# EAGLE schematic ext_board (EAGLE 5.01)
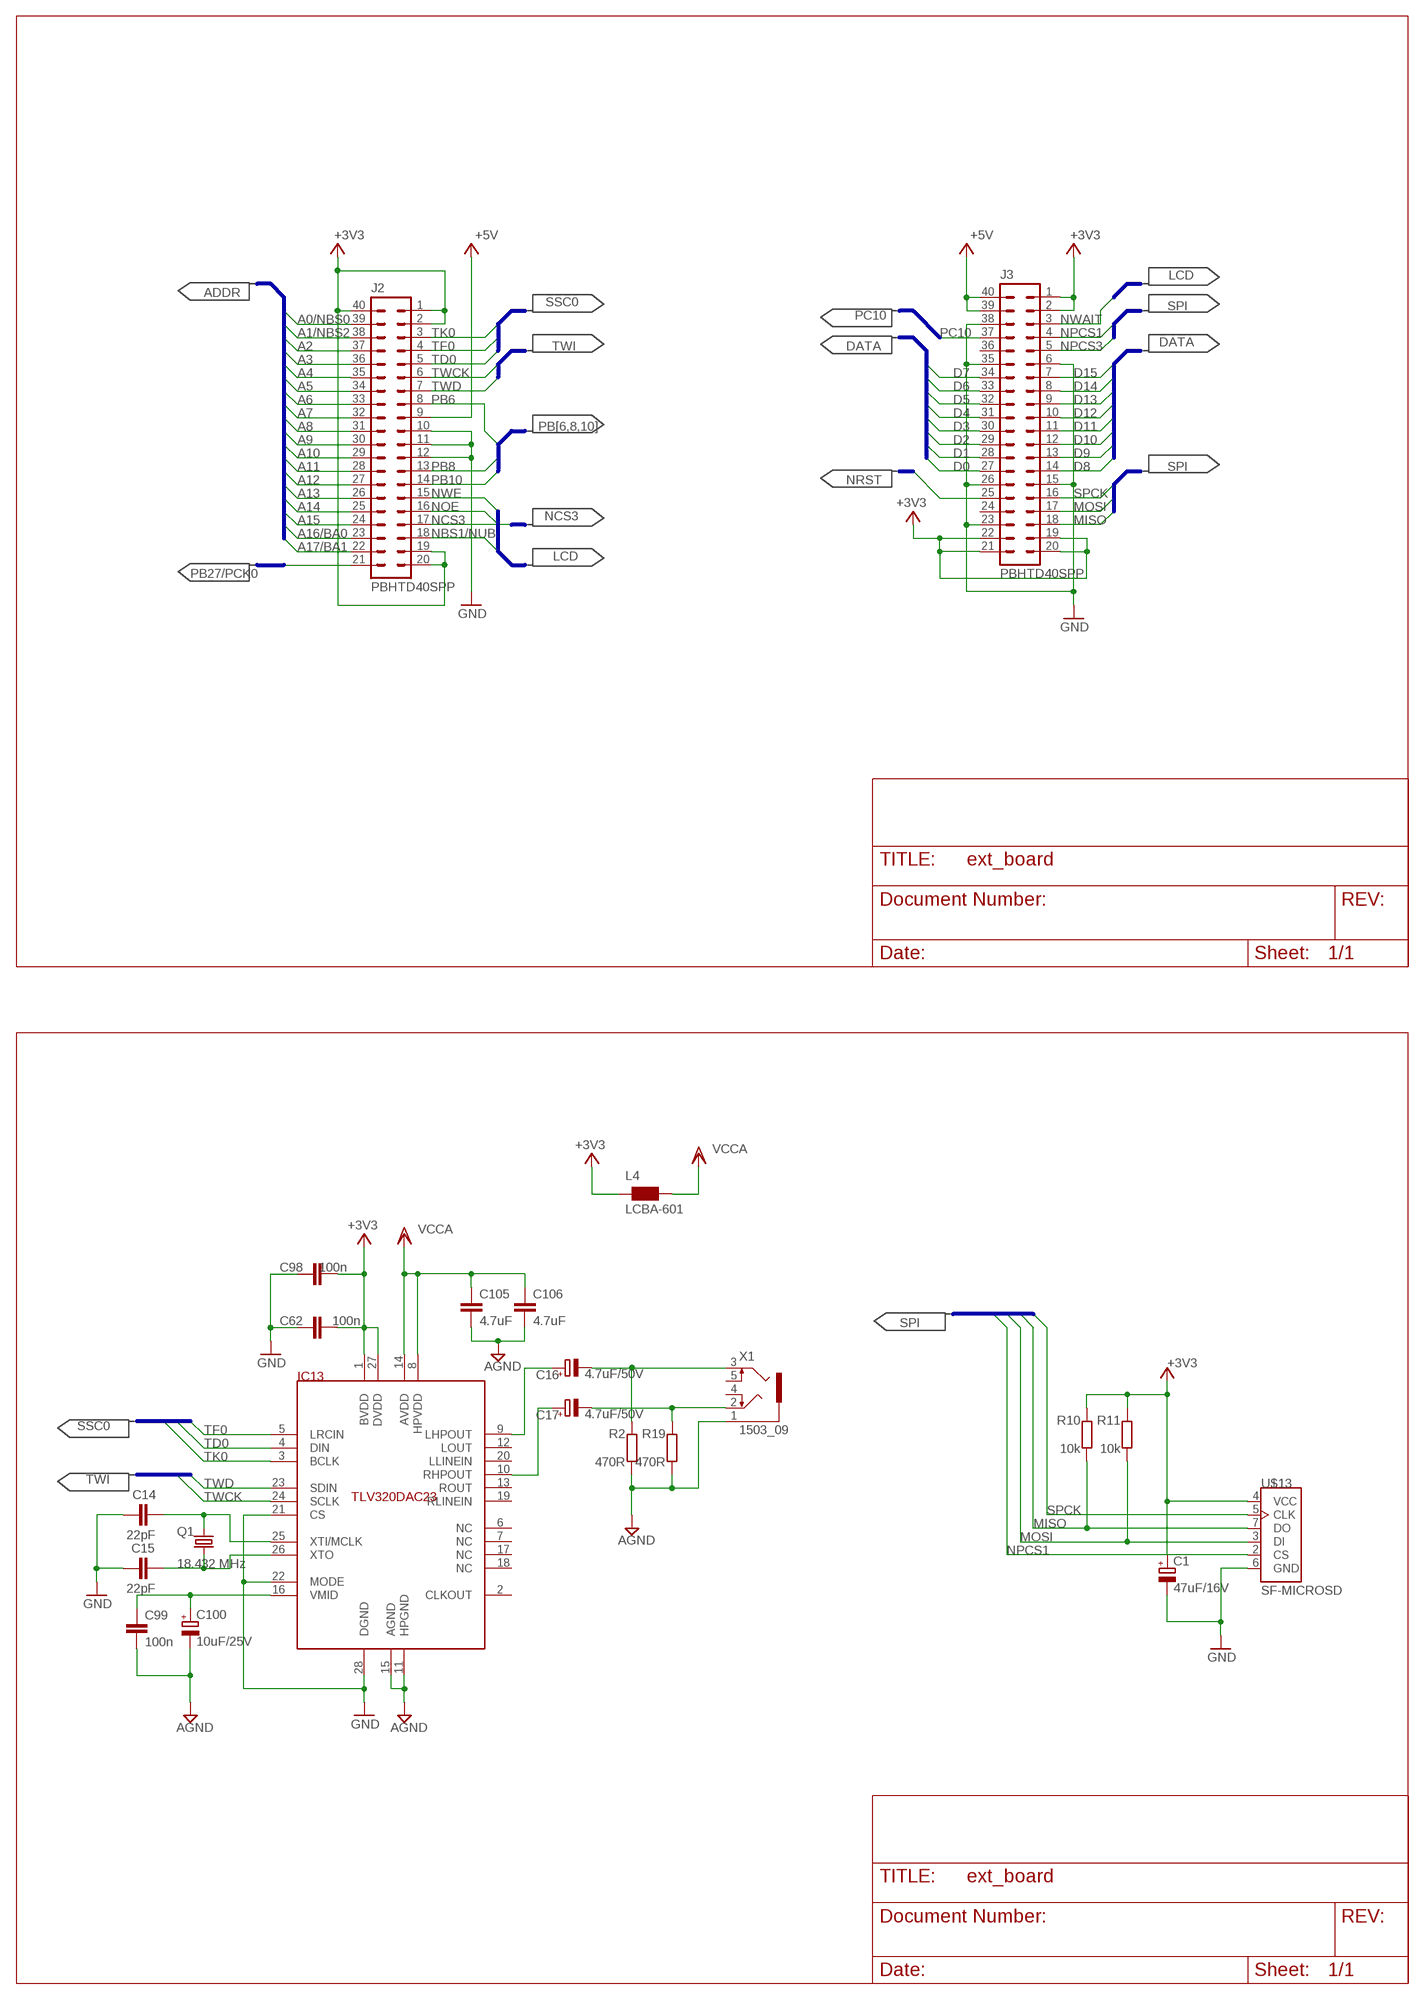
[diagram p0: schematic, sheet 1, part 1 of 2]
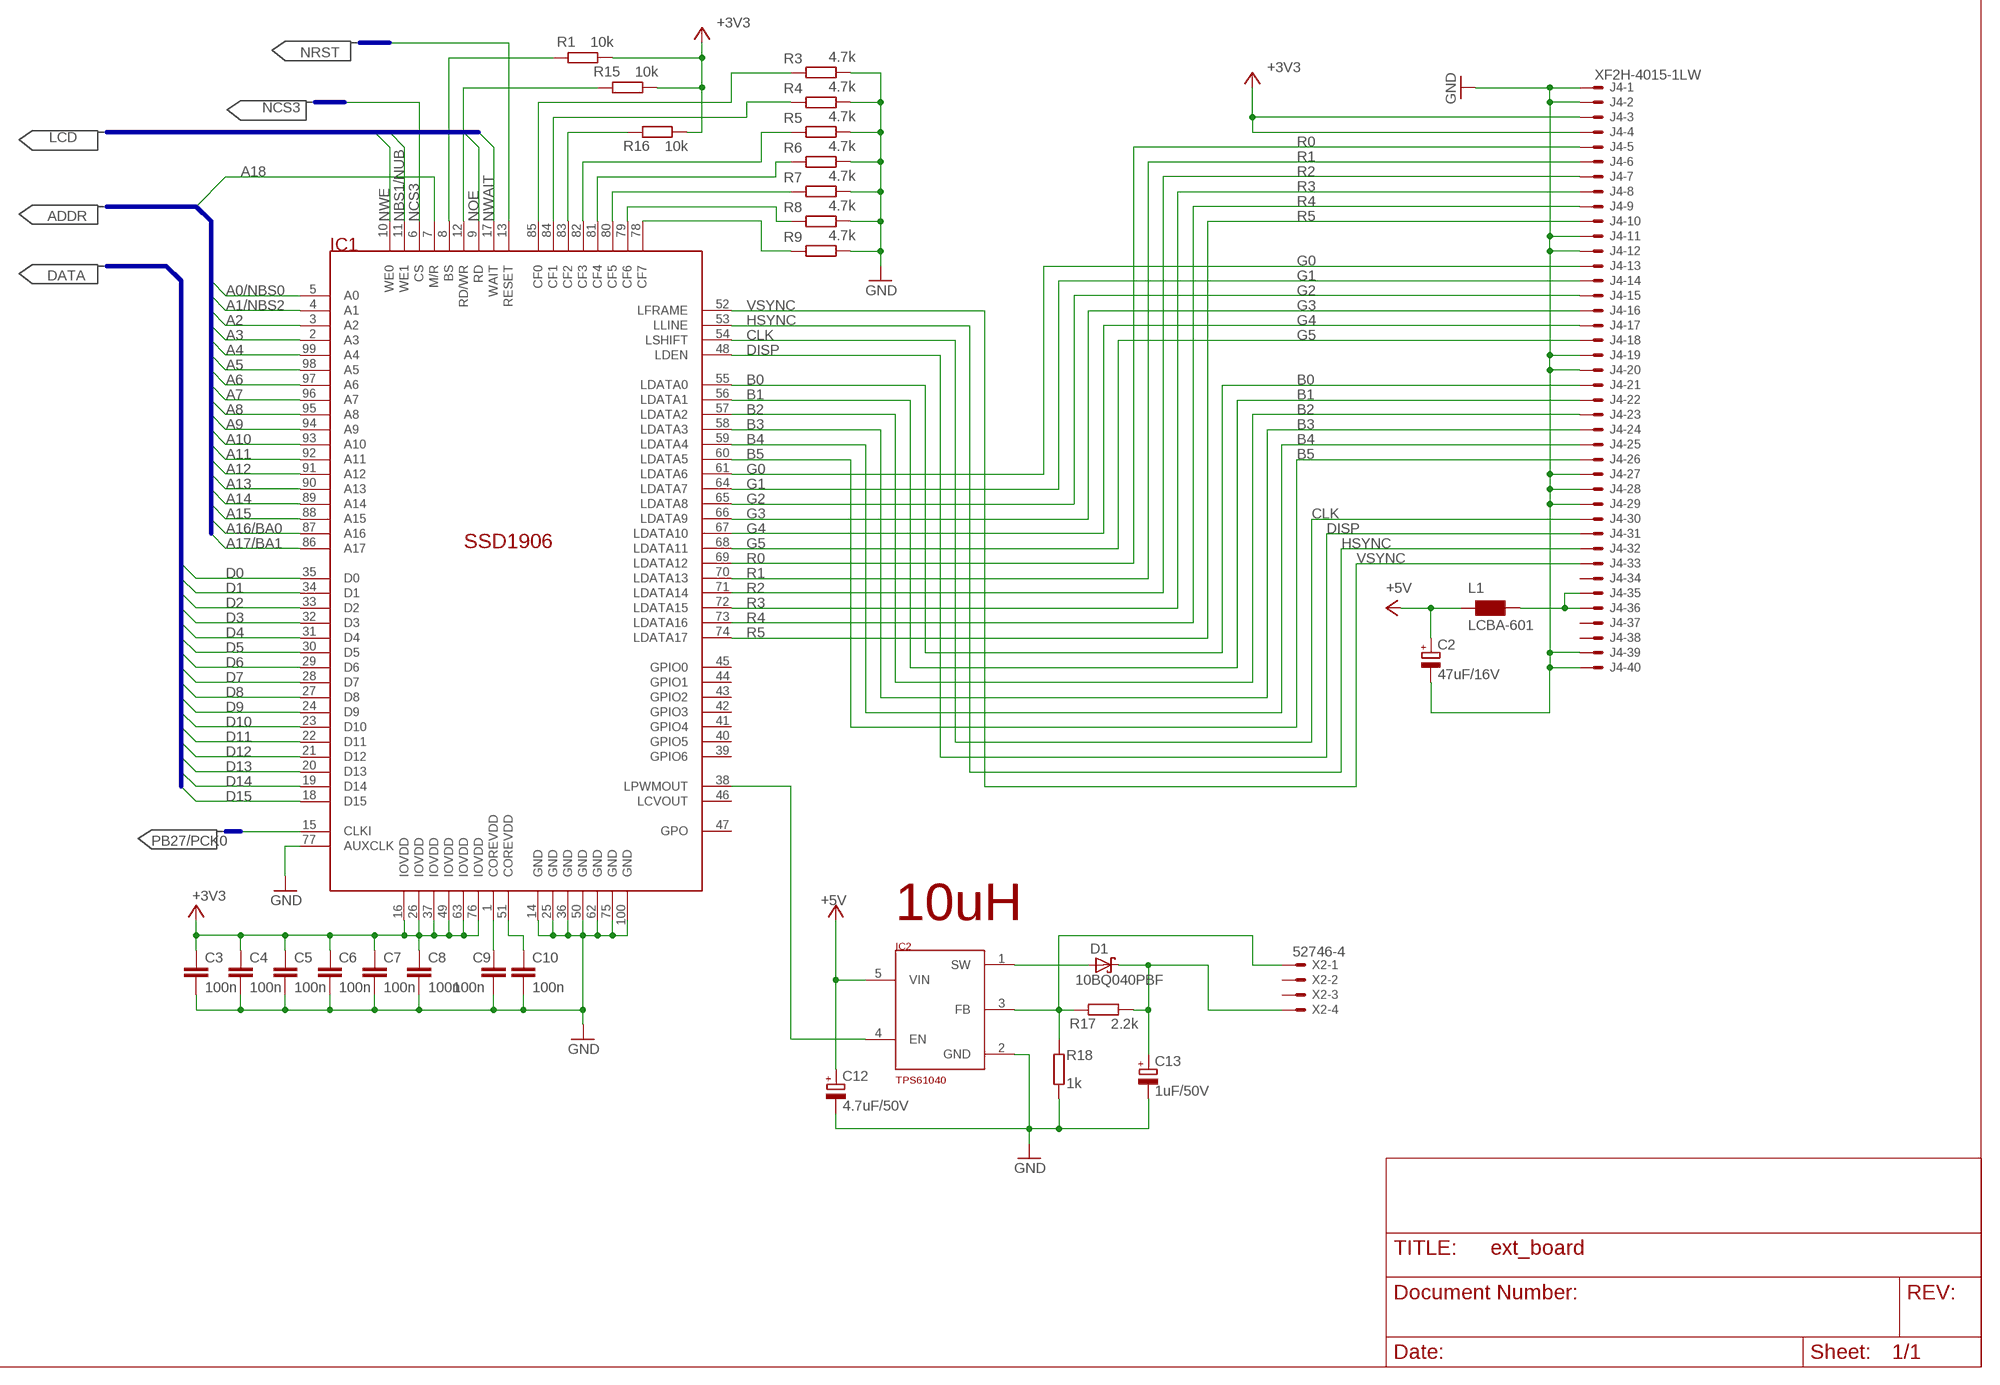
[diagram p1: schematic, sheet 1, part 2 of 2]

## Parts
C1  47uF/16V  CPOL-EU153CLV-0605  [153CLV-0605]
C2  47uF/16V  CPOL-EU153CLV-0605  [153CLV-0605]
C3  100n  C-EUC0603K  [C0603K]
C4  100n  C-EUC0603K  [C0603K]
C5  100n  C-EUC0603K  [C0603K]
C6  100n  C-EUC0603K  [C0603K]
C7  100n  C-EUC0603K  [C0603K]
C8  100n  C-EUC0603K  [C0603K]
C9  100n  C-EUC0603K  [C0603K]
C10  100n  C-EUC0603K  [C0603K]
C12  4.7uF/50V  CPOL-EU153CLV-0405  [153CLV-0405]
C13  1uF/50V  CPOL-EU153CLV-0405  [153CLV-0405]
C14  22pF  C-EUC0805  [C0805]
C15  22pF  C-EUC0805  [C0805]
C16  4.7uF/50V  CPOL-EU153CLV-0405  [153CLV-0405]
C17  4.7uF/50V  CPOL-EU153CLV-0405  [153CLV-0405]
C62  100n  C-EUC0603K  [C0603K]
C98  100n  C-EUC0603K  [C0603K]
C99  100n  C-EUC0603K  [C0603K]
C100  10uF/25V  CPOL-EU153CLV-0405  [153CLV-0405]
C105  4.7uF  C-EUC1206K  [C1206K]
C106  4.7uF  C-EUC1206K  [C1206K]
D1  10BQ040PBF  MBRS130LT3  [SMB]
IC1  SSD1906  [TQFP100]
IC2  TPS61040  [SOT23-5]
IC13  TLV320DAC23  [SSOP28]
J2  PBHTD40SPP  [PLHTD40S-GC]
J3  PBHTD40SPP  [PLHTD40S-GC]
J4  XF2H-4015-1LW  [XF2H-4015-1LW]
L1  LCBA-601  WE-CBF_0603  [0603]
L4  LCBA-601  WE-CBF_0603  [0603]
Q1  18.432 MHz  CRYSTALSM49  [SM49]
R1  10k  R-EU_R0603  [R0603]
R2  470R  R-EU_R0805  [R0805]
R3  4.7k  R-EU_R0805  [R0805]
R4  4.7k  R-EU_R0805  [R0805]
R5  4.7k  R-EU_R0805  [R0805]
R6  4.7k  R-EU_R0805  [R0805]
R7  4.7k  R-EU_R0805  [R0805]
R8  4.7k  R-EU_R0805  [R0805]
R9  4.7k  R-EU_R0805  [R0805]
R10  10k  R-EU_R0603  [R0603]
R11  10k  R-EU_R0603  [R0603]
R15  10k  R-EU_R0603  [R0603]
R16  10k  R-EU_R0603  [R0603]
R17  2.2k  R-EU_R0805  [R0805]
R18  1k  R-EU_R0805  [R0805]
R19  470R  R-EU_R0805  [R0805]
U$13  SF-MICROSD  [MICROSD]
X1  1503_09  [1503_09]
X2  52746-4  [52746-4]

## Nets
+3V3: C1.+ C3.1 C4.1 C5.1 C6.1 C7.1 C8.1 C62.2 C98.2 IC1.16(IOVDD) IC1.26(IOVDD) IC1.37(IOVDD) IC1.49(IOVDD) IC1.63(IOVDD) IC1.76(IOVDD) IC13.1(BVDD) IC13.27(DVDD) J2.1 J2.2 J2.19 J2.20 J2.40 J3.1 J3.2 J3.19 J3.20 J3.21 J3.22 J4.3 J4.4 L4.2 R1.2 R10.2 R11.2 R15.2 R16.2 U$13.4(VCC)
+5V: C2.+ C12.+ IC2.5(VIN) J2.9 J3.39 J3.40 L1.2
A0/NBS0: IC1.5(A0) J2.39
A1/NBS2: IC1.4(A1) J2.38
A2: IC1.3(A2) J2.37
A3: IC1.2(A3) J2.36
A4: IC1.99(A4) J2.35
A5: IC1.98(A5) J2.34
A6: IC1.97(A6) J2.33
A7: IC1.96(A7) J2.32
A8: IC1.95(A8) J2.31
A9: IC1.94(A9) J2.30
A10: IC1.93(A10) J2.29
A11: IC1.92(A11) J2.28
A12: IC1.91(A12) J2.27
A13: IC1.90(A13) J2.26
A14: IC1.89(A14) J2.25
A15: IC1.88(A15) J2.24
A16/BA0: IC1.87(A16) J2.23
A17/BA1: IC1.86(A17) J2.22
A18: IC1.7(M/R)
AGND: C99.2 C100.- C105.2 C106.2 IC13.11(HPGND) IC13.15(AGND) R2.1 R19.1 X1.1
B0: IC1.55(LDATA0) J4.21
B1: IC1.56(LDATA1) J4.22
B2: IC1.57(LDATA2) J4.23
B3: IC1.58(LDATA3) J4.24
B4: IC1.59(LDATA4) J4.25
B5: IC1.60(LDATA5) J4.26
CLK: IC1.54(LSHIFT) J4.30
D0: IC1.35(D0) J3.27
D1: IC1.34(D1) J3.28
D2: IC1.33(D2) J3.29
D3: IC1.32(D3) J3.30
D4: IC1.31(D4) J3.31
D5: IC1.30(D5) J3.32
D6: IC1.29(D6) J3.33
D7: IC1.28(D7) J3.34
D8: IC1.27(D8) J3.14
D9: IC1.24(D9) J3.13
D10: IC1.23(D10) J3.12
D11: IC1.22(D11) J3.11
D12: IC1.21(D12) J3.10
D13: IC1.20(D13) J3.9
D14: IC1.19(D14) J3.8
D15: IC1.18(D15) J3.7
DISP: IC1.48(LDEN) J4.31
G0: IC1.61(LDATA6) J4.13
G1: IC1.64(LDATA7) J4.14
G2: IC1.65(LDATA8) J4.15
G3: IC1.66(LDATA9) J4.16
G4: IC1.67(LDATA10) J4.17
G5: IC1.68(LDATA11) J4.18
GND: C1.- C2.- C3.2 C4.2 C5.2 C6.2 C7.2 C8.2 C9.2 C10.2 C12.- C13.- C14.1 C15.1 C62.1 C98.1 IC1.14(GND) IC1.25(GND) IC1.36(GND) IC1.50(GND) IC1.62(GND) IC1.75(GND) IC1.77(AUXCLK) IC1.100(GND) IC2.2(GND) IC13.21(CS) IC13.22(MODE) IC13.28(DGND) J2.10 J2.11 J2.12 J3.6 J3.15 J3.23 J3.26 J3.35 J3.38 J4.1 J4.2 J4.11 J4.12 J4.19 J4.20 J4.27 J4.28 J4.29 J4.39 J4.40 R3.1 R4.1 R5.1 R6.1 R7.1 R8.1 R9.1 R18.1 U$13.6(GND)
HSYNC: IC1.53(LLINE) J4.32
MISO: J3.18 R10.1 U$13.7(DO)
MOSI: J3.17 R11.1 U$13.3(DI)
N$1: IC1.12(RD/WR) R15.1
N$2: IC1.83(CF2) R16.1
N$3: J4.35 J4.36 L1.1
N$4: D1.A IC2.1(SW)
N$5: IC1.38(LPWMOUT) IC2.4(EN)
N$6: C13.+ D1.C R17.2 X2.4
N$7: IC2.3(FB) R17.1 R18.2 X2.1
N$8: C14.2 IC13.25(XTI/MCLK) Q1.1
N$9: C15.2 IC13.26(XTO) Q1.2
N$14: C10.1 IC1.51(COREVDD)
N$15: C9.1 IC1.1(COREVDD)
N$23: IC1.8(BS) R1.1
N$35: IC1.85(CF0) R3.2
N$36: IC1.84(CF1) R4.2
N$37: IC1.82(CF3) R5.2
N$38: IC1.81(CF4) R6.2
N$39: IC1.80(CF5) R7.2
N$40: IC1.79(CF6) R8.2
N$41: IC1.78(CF7) R9.2
N$65: C99.1 C100.+ IC13.16(VMID)
N$67: C16.+ IC13.9(LHPOUT)
N$68: C17.+ IC13.10(RHPOUT)
N$69: C17.- R19.2 X1.2
N$70: C16.- R2.2 X1.3
NBS1/NUB: IC1.11(WE1) J2.18
NCS3: IC1.6(CS) J2.17
NOE: IC1.9(RD) J2.16
NPCS1: J3.4 U$13.2(CS)
NPCS3: J3.5
NRST: IC1.13(RESET) J3.25
NWAIT: IC1.17(WAIT) J3.3
NWE: IC1.10(WE0) J2.15
PB6: J2.8
PB8: J2.13
PB10: J2.14
PB27/PCK0: IC1.15(CLKI) J2.21
PC10: J3.37
R0: IC1.69(LDATA12) J4.5
R1: IC1.70(LDATA13) J4.6
R2: IC1.71(LDATA14) J4.7
R3: IC1.72(LDATA15) J4.8
R4: IC1.73(LDATA16) J4.9
R5: IC1.74(LDATA17) J4.10
SPCK: J3.16 U$13.5(CLK)
TD0: IC13.4(DIN) J2.5
TF0: IC13.5(LRCIN) J2.4
TK0: IC13.3(BCLK) J2.3
TWCK: IC13.24(SCLK) J2.6
TWD: IC13.23(SDIN) J2.7
VCCA: C105.1 C106.1 IC13.8(HPVDD) IC13.14(AVDD)
VDD: L4.1 ; supply symbol labelled VCCA
VSYNC: IC1.52(LFRAME) J4.33
Unconnected: IC1.39(GPIO6) IC1.40(GPIO5) IC1.41(GPIO4) IC1.42(GPIO3) IC1.43(GPIO2) IC1.44(GPIO1) IC1.45(GPIO0) IC1.46(LCVOUT) IC1.47(GPO) IC13.2(CLKOUT) IC13.6(NC) IC13.7(NC) IC13.12(LOUT) IC13.13(ROUT) IC13.17(NC) IC13.18(NC) IC13.19(RLINEIN) IC13.20(LLINEIN) J3.24 J3.36 J4.34 J4.37 J4.38 X1.4 X1.5 X2.2 X2.3

## Buses
D[0..31]
TWD,TWCK
MISO,MOSI,SPCK,NPCS[0..3]
A0/NBS0,A1/NBS2,A[2..15],A16/BA0,A17/BA1,A[18..25]
TF0,TK0,TD0
NRST
PC10
NWAIT,NOE,NWE,NBS1/NUB
PB6,PB8,PB10
NCS3
PB27/PCK0

## Notes on the sheet
- NRST
- LCD | NCS3
- ADDR | SSC0 | LCD
- PC10 | SPI
- DATA
- TWI | DATA
- ADDR
- PB[6,8,10] | DATA
- SPI
- NRST
- NCS3
- LCD
- PB27/PCK0
- PB27/PCK0
- 10uH
- SPI
- SSC0
- TWI

## Library data of the parts
C1 C2 C12 C13 C16 C17 C100 = rcl:CPOL-EU: POLARIZED CAPACITOR, European symbol
C3-C10 C14 C15 C62 C98 C99 C105 C106 = rcl:C-EU: CAPACITOR, European symbol
D1 = diode:MBRS130LT3: Schottky Power Rectifier Source: http://www.onsemi.com/pub/Collateral/MBRS130LT3-D.PDF
IC1 = mylib:SSD1906: 256K Embedded Display SRAM LCD Graphic Controller
IC2 = mylib:TPS61040
IC13 = mylib:TLV320DAC23: Stereo Audio D/A Converter, 8? to 96?kHz With Integrated Headphone Amplifier
J2 J3 = mylib:PBHTD40SPP
J4 = con-omron:XF2*-40?: OMRON FPC Connector Source : http://www.omron.com/ecb/products/pdf/fpc.pdf
L1 L4 = wuerth-elektronik:WE-CBF: SMD EMI Suppression Ferrite Beads - excellent anti-EMI properties - low DCR - impedances till 3000 ohms - rated current up to 6 A
Q1 = crystal:CRYSTAL: CRYSTAL
R1-R11 R15-R19 = rcl:R-EU_: RESISTOR, European symbol
U$13 = microsd:SF-MICROSD
X1 = con-lumberg:1503_09: Jack connectors according to JISC 6560, 3.5 mm Klinkeneinbaukupplung nach JISC 6560, 3,5 mm, 3-polig/ stereo, abgewinkelte Ausführung, mit 2 Öffnern und Lötaugen, für Leiterplatten Rückseitenmontage Source: http://www.lumberg.com/Produkte/PDFs/1503_09.pdf
X2 = con-molex:52746-4: FPC Connector ZIF for SMT 0.5mm Source: http://www.farnell.com/datasheets/73044.pdf [DWG. NO. (Sheet 1 OF 2) SD-52746-**17]